# Altium schematic sheet Filter Capacitors - Master ICSP.SchDoc: Master ICSP Filter Capacitors
size A4; DocumentNumber: 33; SheetNumber: 30; SheetTotal: 54
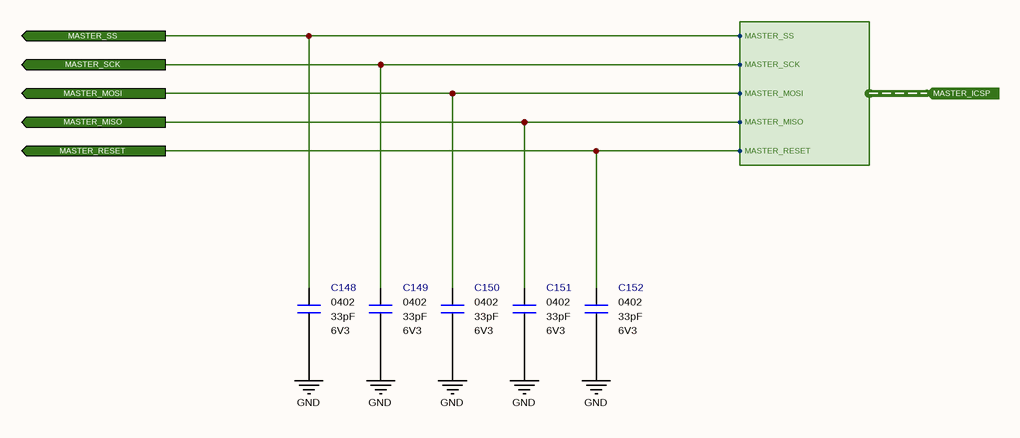
[diagram p0: Filter Capacitors - Master ICSP.SchDoc]

## Parts
C148  value 33pF  Case: 0402  Voltage: 6V3  [CAPACITOR_0402]  (hidden comment: Multilayer Ceramic Capacitor)
C149  value 33pF  Case: 0402  Voltage: 6V3  [CAPACITOR_0402]  (hidden comment: Multilayer Ceramic Capacitor)
C150  value 33pF  Case: 0402  Voltage: 6V3  [CAPACITOR_0402]  (hidden comment: Multilayer Ceramic Capacitor)
C151  value 33pF  Case: 0402  Voltage: 6V3  [CAPACITOR_0402]  (hidden comment: Multilayer Ceramic Capacitor)
C152  value 33pF  Case: 0402  Voltage: 6V3  [CAPACITOR_0402]  (hidden comment: Multilayer Ceramic Capacitor)

## Ports
MASTER_ICSP (in, harness MASTER_ICSP), MASTER_MISO (out), MASTER_MOSI (out), MASTER_RESET (out), MASTER_SCK (out), MASTER_SS (out)

## Harnesses
MASTER_ICSP: MASTER_RESET, MASTER_SCK, MASTER_MISO, MASTER_MOSI, MASTER_SS

## Nets
GND: C148.1 C149.1 C150.1 C151.1 C152.1
MASTER_MISO: C151.2 ; port MASTER_MISO, port MASTER_ICSP.MASTER_MISO
MASTER_MOSI: C150.2 ; port MASTER_MOSI, port MASTER_ICSP.MASTER_MOSI
MASTER_RESET: C152.2 ; port MASTER_RESET, port MASTER_ICSP.MASTER_RESET
MASTER_SCK: C149.2 ; port MASTER_SCK, port MASTER_ICSP.MASTER_SCK
MASTER_SS: C148.2 ; port MASTER_SS, port MASTER_ICSP.MASTER_SS

## Notes on the sheet
- Engineer
- All Rights are reserved to Customer and Engineer. [2021]
- Size:
- Date:
- A4
- Project :
- Time:
- Sheet
- of
- Customer
- Product ID
- Module ID
- Version
- File:
- Revision

## Library data of the parts
C148-C152 = Capacitor - 33pF [0402-6V3]: Capacitor - 33pF [0402] (Ceramic); Manufacturer Name: Kemet; Manufacturer Part Number: C0402C330J9RACAUTO; Dielectric: X7R; Tolerance: 10%; Height: 0.5mm; Maximum Operating Temperature: +125; Minimum Operating Temperature: -55; ROHS: Yes; ComponentLink1Description: DataSheet; ComponentLink1URL: https://api.kemet.com/component-edge/download/datasheet/C0402C330J9RACAUTO.pdf; ComponentLink2Description: Mouser; ComponentLink2URL: https://www.mouser.com/Search/Refine.aspx?Keyword=80-C0402C330J9RAUTO; Supplier 1: Mouser; Supplier Part Number 1: 80-C0402C330J9RAUTO; Mouser Part Number: 80-C0402C330J9RAUTO